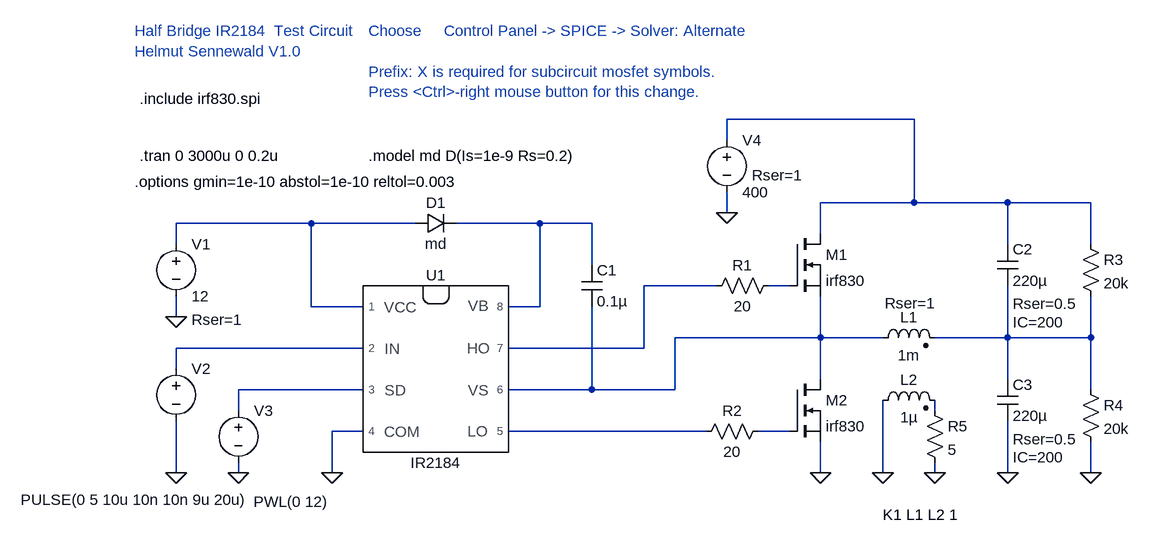
[diagram p0: schematic IR2184_test.asc]
IR2184_test.asc, the LTspice schematic file:
Version 4
SHEET 1 1188 680
WIRE 848 -144 560 -144
WIRE 560 -112 560 -144
WIRE 848 -16 848 -144
WIRE 848 -16 704 -16
WIRE 992 -16 848 -16
WIRE 1120 -16 992 -16
WIRE 560 0 560 -32
WIRE -80 16 -288 16
WIRE 80 16 -80 16
WIRE 272 16 144 16
WIRE 352 16 272 16
WIRE 704 32 704 -16
WIRE -288 48 -288 16
WIRE 992 48 992 -16
WIRE 1120 48 1120 -16
WIRE 352 80 352 16
WIRE 544 112 432 112
WIRE 656 112 624 112
WIRE -80 144 -80 16
WIRE 0 144 -80 144
WIRE 272 144 272 16
WIRE 272 144 224 144
WIRE -288 160 -288 128
WIRE 704 192 704 128
WIRE 704 192 480 192
WIRE 800 192 704 192
WIRE 992 192 992 112
WIRE 992 192 880 192
WIRE 1120 192 1120 128
WIRE 1120 192 992 192
WIRE 0 208 -288 208
WIRE 432 208 432 112
WIRE 432 208 224 208
WIRE -288 240 -288 208
WIRE 704 256 704 192
WIRE 992 256 992 192
WIRE 0 272 -192 272
WIRE 352 272 352 144
WIRE 352 272 224 272
WIRE 480 272 480 192
WIRE 480 272 352 272
WIRE 1120 272 1120 192
WIRE -192 304 -192 272
WIRE 880 304 880 288
WIRE 0 336 -48 336
WIRE 528 336 224 336
WIRE 656 336 608 336
WIRE -288 400 -288 320
WIRE -192 400 -192 384
WIRE -48 400 -48 336
WIRE 704 400 704 352
WIRE 800 400 800 288
WIRE 880 400 880 384
WIRE 992 400 992 320
WIRE 1120 400 1120 352
FLAG -48 400 0
FLAG -288 160 0
FLAG -288 400 0
FLAG -192 400 0
FLAG 704 400 0
FLAG 992 400 0
FLAG 1120 400 0
FLAG 880 400 0
FLAG 800 400 0
FLAG 560 0 0
SYMBOL voltage -288 32 R0
WINDOW 123 0 0 Left 0
WINDOW 39 24 132 Left 0
SYMATTR SpiceLine Rser=1
SYMATTR InstName V1
SYMATTR Value 12
SYMBOL voltage -288 224 R0
WINDOW 3 -239 217 Left 0
WINDOW 123 0 0 Left 0
WINDOW 39 0 0 Left 0
SYMATTR Value PULSE(0 5 10u 10n 10n 9u 20u)
SYMATTR InstName V2
SYMBOL voltage -192 288 R0
WINDOW 3 23 156 Left 0
WINDOW 123 0 0 Left 0
WINDOW 39 0 0 Left 0
SYMATTR Value PWL(0 12)
SYMATTR InstName V3
SYMBOL diode 80 32 R270
WINDOW 0 32 32 VTop 0
WINDOW 3 0 32 VBottom 0
SYMATTR InstName D1
SYMATTR Value md
SYMBOL cap 336 80 R0
SYMATTR InstName C1
SYMATTR Value 0.1µ
SYMBOL nmos 656 32 R0
SYMATTR InstName M1
SYMATTR Value irf830
SYMATTR Prefix X
SYMBOL nmos 656 256 R0
SYMATTR InstName M2
SYMATTR Value irf830
SYMATTR Prefix X
SYMBOL res 528 128 R270
WINDOW 0 32 56 VTop 0
WINDOW 3 0 56 VBottom 0
SYMATTR InstName R1
SYMATTR Value 20
SYMBOL res 512 352 R270
WINDOW 0 32 56 VTop 0
WINDOW 3 0 56 VBottom 0
SYMATTR InstName R2
SYMATTR Value 20
SYMBOL cap 976 48 R0
WINDOW 123 24 92 Left 0
WINDOW 39 24 120 Left 0
SYMATTR Value2 Rser=0.5
SYMATTR SpiceLine IC=200
SYMATTR InstName C2
SYMATTR Value 220µ
SYMBOL cap 976 256 R0
WINDOW 123 24 92 Left 0
WINDOW 39 24 120 Left 0
SYMATTR Value2 Rser=0.5
SYMATTR SpiceLine IC=200
SYMATTR InstName C3
SYMATTR Value 220µ
SYMBOL res 1104 32 R0
SYMATTR InstName R3
SYMATTR Value 20k
SYMBOL res 1104 256 R0
SYMATTR InstName R4
SYMATTR Value 20k
SYMBOL ind2 784 208 R270
WINDOW 0 32 56 VTop 0
WINDOW 3 5 56 VBottom 0
WINDOW 39 85 58 VBottom 0
SYMATTR InstName L1
SYMATTR Value 1m
SYMATTR SpiceLine Rser=1
SYMATTR Type ind
SYMBOL ind2 784 304 R270
WINDOW 0 32 56 VTop 0
WINDOW 3 5 56 VBottom 0
SYMATTR InstName L2
SYMATTR Value 1µ
SYMATTR Type ind
SYMBOL res 864 288 R0
SYMATTR InstName R5
SYMATTR Value 5
SYMBOL voltage 560 -128 R0
WINDOW 123 0 0 Left 0
WINDOW 39 38 70 Left 0
SYMATTR SpiceLine Rser=1
SYMATTR InstName V4
SYMATTR Value 400
SYMBOL ir2184 112 240 R0
SYMATTR InstName U1
TEXT 800 464 Left 0 !K1 L1 L2 1
TEXT -344 -176 Left 0 !.include irf830.spi
TEXT -344 -88 Left 0 !.tran 0 3000u 0 0.2u
TEXT 8 -280 Left 0 ;Choose     Control Panel -> SPICE -> Solver: Alternate\n \nPrefix: X is required for subcircuit mosfet symbols.\nPress <Ctrl>-right mouse button for this change.
TEXT 8 -88 Left 0 !.model md D(Is=1e-9 Rs=0.2)
TEXT -352 -280 Left 0 ;Half Bridge IR2184  Test Circuit\nHelmut Sennewald V1.0
TEXT -352 -48 Left 0 !.options gmin=1e-10 abstol=1e-10 reltol=0.003

The netlist it stands for:
* IR2184_test.asc
V1 N002 0 12 Rser=1
V2 N008 0 PULSE(0 5 10u 10n 10n 9u 20u)
V3 N009 0 PWL(0 12)
D1 N002 N003 md
C1 N003 N006 0.1µ
XM1 N001 N005 N006 irf830  ; pins D G S
XM2 N006 N012 0 irf830  ; pins D G S
R1 N004 N005 20
R2 N011 N012 20
C2 N001 N007 220µ Rser=0.5 IC=200
C3 N007 0 220µ Rser=0.5 IC=200
R3 N001 N007 20k
R4 N007 0 20k
L1 N006 N007 1m Rser=1
L2 0 N010 1µ
R5 N010 0 5
V4 N001 0 400 Rser=1
XU1 N002 N008 N009 0 N003 N004 N006 N011 IR2184  ; pins 1 2 3 4 8 7 6 5
.model D D
.lib standard.dio
K1 L1 L2 1
.include irf830.spi
.tran 0 3000u 0 0.2u
* Choose     Control Panel -> SPICE -> Solver: Alternate
* Prefix: X is required for subcircuit mosfet symbols.
* Press <Ctrl>-right mouse button for this change.
.model md D(Is=1e-9 Rs=0.2)
* Half Bridge IR2184  Test Circuit
* Helmut Sennewald V1.0
.options gmin=1e-10 abstol=1e-10 reltol=0.003
.lib IR2184.sub
.backanno
.end